# Altium schematic sheet BMS_Controler.SchDoc
size A4
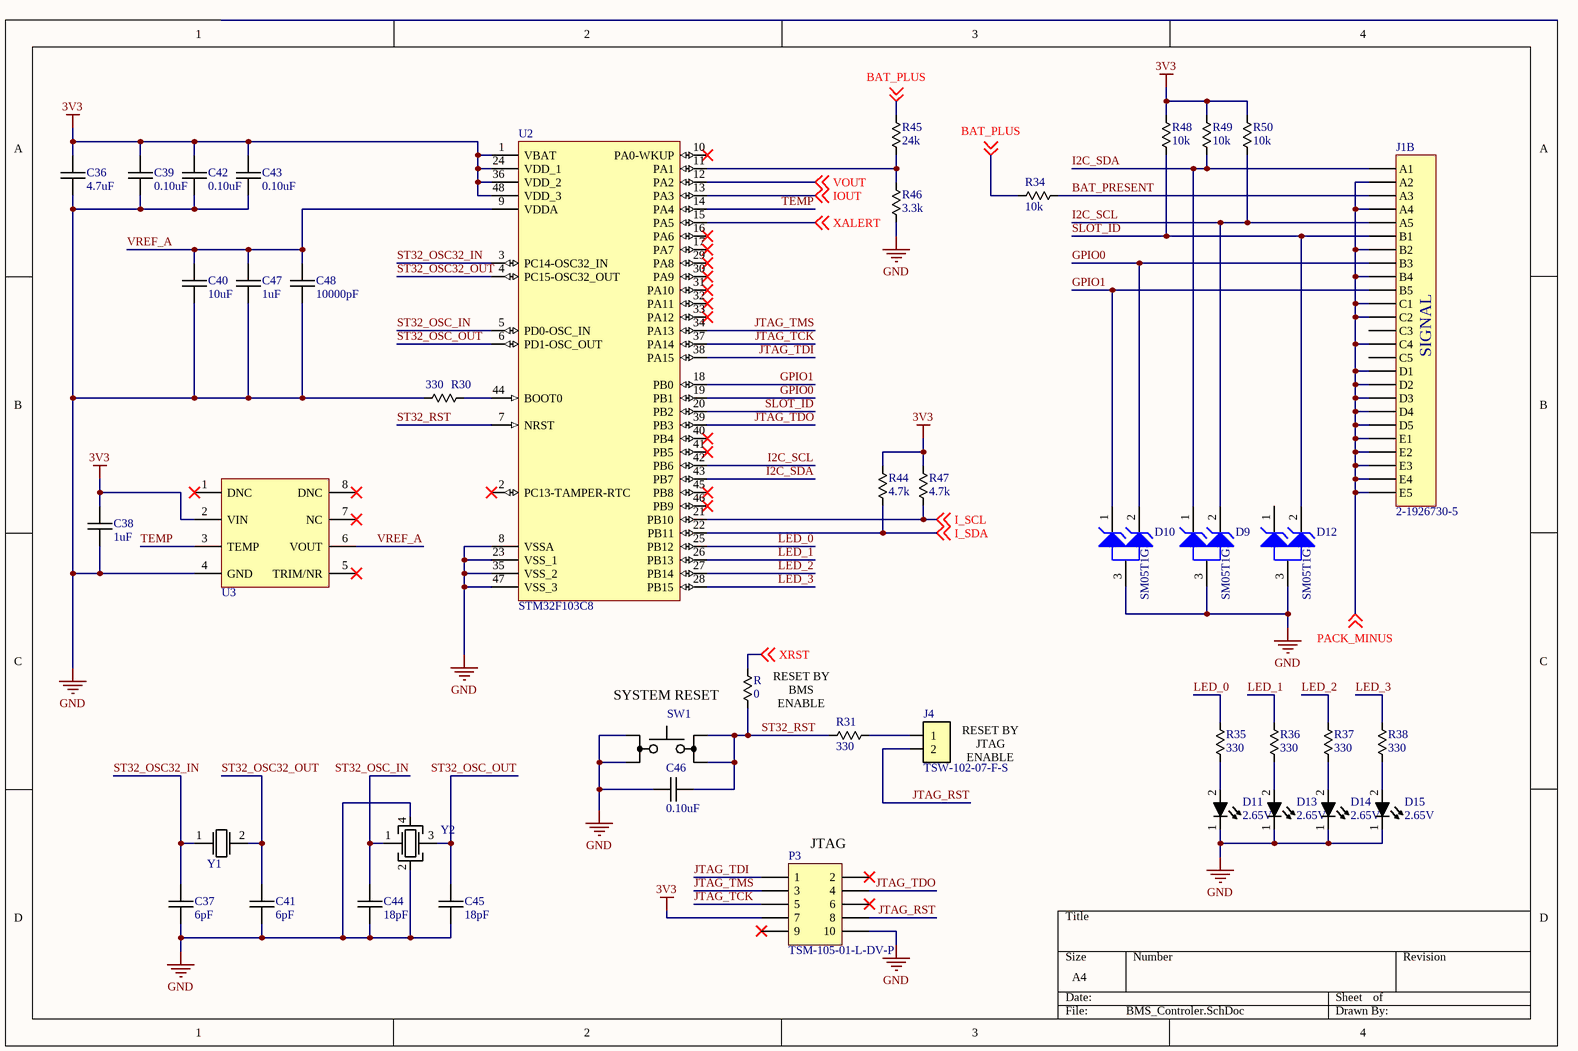
[diagram p0: BMS_Controler.SchDoc]

## Parts
C36  4.7uF  [chip_0805]
C37  6pF  [chip_0603]
C38  1uF  [chip_0805]
C39  0.10uF  [chip_0805]
C40  10uF  [chip_0805]
C41  6pF  [chip_0603]
C42  0.10uF  [chip_0805]
C43  0.10uF  [chip_0805]
C44  18pF  [chip_0603]
C45  18pF  [chip_0603]
C46  0.10uF  [chip_0805]
C47  1uF  [chip_0805]
C48  10000pF  [chip_0805]
D9  SM05T1G  [ONSC-SOT-23-3-318-08_V]
D10  SM05T1G  [ONSC-SOT-23-3-318-08_V]
D11  2.65V  [APA2107]
D12  SM05T1G  [ONSC-SOT-23-3-318-08_V]
D13  2.65V  [APA2107]
D14  2.65V  [APA2107]
D15  2.65V  [APA2107]
J1  2-1926730-5  [TE_CONN_2-1926730-5]  (part B of 2)
J4  TSW-102-07-F-S  [HDDR_2x1_0]
P3  TSM-105-01-L-DV-P  [SAMTEC_SMD_HDDR_5x2]
R30  330  [chip_0805]
R31  330  [chip_0805]
R34  10k  [chip_0805]
R35  330  [chip_0805]
R36  330  [chip_0805]
R37  330  [chip_0805]
R38  330  [chip_0805]
R43  0  [chip_0805]
R44  4.7k  [chip_0805]
R45  24k  [chip_0805]
R46  3.3k  [chip_0805]
R47  4.7k  [chip_0805]
R48  10k  [chip_0805]
R49  10k  [chip_0805]
R50  10k  [chip_0805]
SW1  SW_1P1T_2  [B3FS-1000]  (value not drawn)
U2  STM32F103C8  [LQFP48_0]
U3  REF50xx  [SO-8_1]  (value not drawn)
Y1  osc_xtal_2p_0  [ABS25_OSC]  (value not drawn)
Y2  osc_xtal_4p_1-3  [ECX-53B]  (value not drawn)

## Nets
3V3: C36.2 C38.2 C39.1 C42.1 C43.1 P3.7 R44.1 R47.1 R48.2 R49.2 R50.2 U2.1(VBAT) U2.24(VDD_1) U2.36(VDD_2) U2.48(VDD_3) U3.2(VIN)
GND: C36.1 C37.2 C38.1 C39.2 C40.2 C41.1 C42.2 C43.2 C44.2 C45.2 C46.1 C47.1 C48.2 D9.3(A) D10.3(A) D11.1 D12.3(A) D13.1 D14.1 D15.1 P3.10 R30.1 R46.2 SW1.1 SW1.2 U2.8(VSSA) U2.23(VSS_1) U2.35(VSS_2) U2.47(VSS_3) U3.4(GND) Y2.2(GND) Y2.4(GND)
BAT_PLUS: R34.1 R45.1 ; off-sheet BAT_PLUS
BAT_PRESENT: J1.A3 R34.2
GPIO0: D10.2(K2) J1.B3 U2.19(PB1)
GPIO1: D10.1(K1) J1.B5 U2.18(PB0)
I2C_SCL: D9.2(K2) J1.A5 R50.1 U2.42(PB6)
I2C_SDA: D9.1(K1) J1.A1 R49.1 U2.43(PB7)
I_SCL: R47.2 U2.21(PB10) ; off-sheet I_SCL
I_SDA: R44.2 U2.22(PB11) ; off-sheet I_SDA
IOUT: U2.13(PA3) ; off-sheet IOUT
JTAG_RST: J4.2 P3.8
JTAG_TCK: P3.5 U2.37(PA14)
JTAG_TDI: P3.1 U2.38(PA15)
JTAG_TDO: P3.4 U2.39(PB3)
JTAG_TMS: P3.3 U2.34(PA13)
LED_0: R35.1 U2.25(PB12)
LED_1: R36.1 U2.26(PB13)
LED_2: R37.1 U2.27(PB14)
LED_3: R38.1 U2.28(PB15)
PACK_MINUS: J1.A2 J1.A4 J1.B2 J1.B4 J1.C1 J1.C2 J1.C4 J1.D1 J1.D2 J1.D3 J1.D4 J1.D5 J1.E1 J1.E2 J1.E3 J1.E4 J1.E5 ; off-sheet PACK_MINUS
SLOT_ID: D12.2(K2) J1.B1 R48.1 U2.20(PB2)
ST32_OSC32_IN: C37.1 U2.3(PC14-OSC32_IN) Y1.1
ST32_OSC32_OUT: C41.2 U2.4(PC15-OSC32_OUT) Y1.2
ST32_OSC_IN: C44.1 U2.5(PD0-OSC_IN) Y2.1
ST32_OSC_OUT: C45.1 U2.6(PD1-OSC_OUT) Y2.3
ST32_RST: C46.2 R31.1 R43.2 SW1.3 SW1.4 U2.7(NRST)
TEMP: U2.14(PA4) U3.3(TEMP)
VOUT: U2.12(PA2) ; off-sheet VOUT
VREF_A: C40.1 C47.2 C48.1 U2.9(VDDA) U3.6(VOUT)
XALERT: U2.15(PA5) ; off-sheet XALERT
XRST: R43.1 ; off-sheet XRST
NetD11_2: D11.2 R35.2
NetD13_2: D13.2 R36.2
NetD14_2: D14.2 R37.2
NetD15_2: D15.2 R38.2
NetJ4_1: J4.1 R31.2
NetR30_2: R30.2 U2.44(BOOT0)
NetR45_2: R45.2 R46.1 U2.11(PA1)

Not connected (* = marked no-connect by the designer): D12 1(K1); J1 C3 C5; P3 2* 6* 9*; U2 2(PC13-TAMPER-RTC)* 10(PA0-WKUP)* 16(PA6)* 17(PA7)* 29(PA8)* 30(PA9)* 31(PA10)* 32(PA11)* 33(PA12)* 40(PB4)* 41(PB5)* 45(PB8)* 46(PB9)*; U3 1(DNC)* 5(TRIM/NR)* 7(NC)* 8(DNC)*

## Notes on the sheet
- SYSTEM RESET
- (near R43) RESET BY BMS
  ENABLE
- (near J4) RESET BY JTAG
  ENABLE
- (near P3) JTAG
- (in symbol CONN-00093, part B) SIGNAL

## Library data of the parts
C36 = CAP-00128: CAP, 4.7uF, 10%, 25V, X7R, 0805; Manufacturer: Murata; Manufacturer PN: GRM21BR71E475KA73L; Part Number: CAP-00128; Capacitance: 4.7uF; Tolerance: 10%; Voltage Rating: 25V; Type: X7R
C37 C41 = CAP-00538: CAP, 6pF, ±10%, 50V, C0G, 0603; Part Number: CAP-00538; Capacitance: 6pF; Tolerance: ±10%; Voltage Rating: 50V; Type: C0G
C38 C47 = CAP-00109: CAP, 1uF, 10%, 50V, X7R, 0805; Manufacturer: Murata; Manufacturer PN: GRM21BR71H105KA12L; Part Number: CAP-00109; Capacitance: 1uF; Tolerance: 10%; Voltage Rating: 50V; Type: X7R
C39 C42 C43 C46 = CAP-00072: CAP, 0.10uF, 10%, 50V, X7R, 0805; Manufacturer: Murata; Manufacturer PN: GRM21BR71H104KA01K; Part Number: CAP-00072; Capacitance: 0.10uF; Tolerance: 10%; Voltage Rating: 50V; Type: X7R
C40 = CAP-00131: CAP, 10uF, 10%, 10V, X7R, 0805; Manufacturer: Murata; Manufacturer PN: GRM21BR71A106KA73L; Part Number: CAP-00131; Capacitance: 10uF; Tolerance: 10%; Voltage Rating: 10V; Type: X7R
C44 C45 = CAP-00417: CAP, 18pF, ±1%, 50V, C0G, 0603; Manufacturer: Murata; Manufacturer PN: GRM1885C1H180FA01J; Part Number: CAP-00417; Capacitance: 18pF; Tolerance: ±1%; Voltage Rating: 50V; Type: C0G
C48 = CAP-00045: CAP, 10000pF, 10%, 25V, X7R, 0805; Manufacturer: Murata; Manufacturer PN: GRM216R71E103KA01D; Part Number: CAP-00045; Capacitance: 10000pF; Tolerance: 10%; Voltage Rating: 25V; Type: X7R
D9 D10 D12 = CMP-1061-00666-1: Transient Voltage Suppressor Diode Array, Dual Common Anode Diodes for ESD Protection, 3-Pin SOT-23, Pb-Free, Tape and Reel; Manufacturer: On Semiconductor; Direction: Unidirectional; IR Max (uA): 10; PPK Max (W): 300; ComponentLink2Description: Datasheet; PackageVersion: Rev. AP, 11/2009; ComponentLink2URL: http://www.onsemi.com/pub_link/Collateral/SM12T1-D.PDF; DatasheetVersion: Rev. 6; Packing: Tape and Reel; PartNumber: SM05T1G; ComponentLink3Description: Package Specification; ComponentLink1URL: http://www.onsemi.com/; ComponentLink3URL: http://www.onsemi.cn/pub_link/Collateral/318-08.PDF; PackageReference: SOT-23-3-318-08; ComponentLink1Description: Manufacturer URL; PackageDescription: 3-Pin Small Outline Transistor, Body 2.92 x 1.3 mm, Pitch 0.95 mm; Mounting Technology: Surface Mount; RoHS: Pb-Free
D11 D13-D15 = DIO-00083: LED, Green, SMD Right-Angle, Low-Current, Kingbright HELI2 Series; Manufacturer PN: APA2107LZGCK; Reverse Breakdown Voltage: 5V; Power Rating: 102.5mW; Current Rating: 25mA; Part Number: DIO-00083; Forward Voltage: 2.65V; Type: LED; Manufacturer: Kingbright; Cost: 0.51
J1 = CONN-00093: Backplane Header, Blades and Pins, Edge Mount Right Angle, 10 Power 25 Signal; Manufacturer: TE Connectivity; Positions per level: 35; Levels: 1; Part Number: CONN-00093; Type: Header; Manufacturer PN: 2-1926730-5; Cost: 11.68
J4 = CONN-00055: Header, 2x1, 0.1"; Manufacturer: Samtec; Positions per level: 2; Levels: 1; Part Number: CONN-00055; Type: Header; Manufacturer PN: TSW-102-07-F-S; Cost: 0.2
P3 = CONN-00071: Header, 5x2, 0.1", SMD; Manufacturer: Samtec; Positions per level: 5; Levels: 2; Part Number: CONN-00071; Type: Header; Manufacturer PN: TSM-105-01-L-DV-P; Cost: 1.17
R30 R31 R35-R38 = RES-00222: RES SMD 330 OHM 1% 1/8W 0805; Manufacturer: Rohm Semiconductor; Manufacturer PN: KTR10EZPF3300; Power Rating: 0.125W; Part Number: RES-00222; Resistance: 330; Tolerance: 1%
R34 R48-R50 = RES-00307: RES SMD 10K OHM 1% 1/8W 0805; Manufacturer: Rohm Semiconductor; Manufacturer PN: KTR10EZPF1002; Power Rating: 0.125W; Part Number: RES-00307; Resistance: 10k; Tolerance: 1%
R43 = RES-00720: RES SMD 0 OHM 1/8W 0805 Thick Film; Manufacturer: Stackpole; Manufacturer PN: RMCF0805ZT0R00; Tolerance: Jumper; Part Number: RES-00720; Resistance: 0; Power Rating: 1/8W; Cost: 0.1
R44 R47 = RES-00471: RES SMD 4.7K OHM 1% 1/8W 0805; Manufacturer: Rohm Semiconductor; Manufacturer PN: KTR10EZPF4701; Power Rating: 0.125W; Part Number: RES-00471; Resistance: 4.7k; Tolerance: 1%
R45 = RES-00400: RES SMD 24K OHM 1% 1/8W 0805; Manufacturer: Rohm Semiconductor; Manufacturer PN: KTR10EZPF2402; Power Rating: 0.125W; Part Number: RES-00400; Resistance: 24k; Tolerance: 1%
R46 = RES-00420: RES SMD 3.3K OHM 1% 1/8W 0805; Manufacturer: Rohm Semiconductor; Manufacturer PN: KTR10EZPF3301; Power Rating: 0.125W; Part Number: RES-00420; Resistance: 3.3k; Tolerance: 1%
SW1 = MISC-00042: Switch, SPST-NO, Tactile, 6.3x6.0mm, SMD, 50mA 24VDC; Manufacturer: Omron; Manufacturer PN: B3FS-1012P; Part Number: MISC-00042; Cost: 0.71
U2 = UCTRL-00008: STM32 M3, LQFP-48; Manufacturer: ST; Part Number: UCTRL-00008; Manufacturer PN: STM32F103C8
U3 = ANLG-00055: IC, Voltage Reference, 2.5V, 3ppm/°C, REF5020; Manufacturer: TI; Manufacturer PN: REF5025AIDR; Part Number: ANLG-00055; Cost: 3
Y1 = OSC-00003: XTAL, 32.768kHz, 6pF, 20ppm; Manufacturer: Abracon; Manufacturer PN: ABS25-32.768KHZ-6-T; ESR: 50k; Part Number: OSC-00003; Frequency: 32.768k; Load Capacitance: 6pF; Tolerance: 20ppm
Y2 = OSC-00006: XTAL, 8MHz, 10pF, 10ppm; Manufacturer: ECS Inc.; Manufacturer PN: ECS-80-10-30B-CWN-TR; Frequency: 8M; ESR: 100; Stability: 15ppm; Part Number: OSC-00006; Load Capacitance: 10pF; Tolerance: 10ppm; Cost: 0.86